# EAGLE schematic drone_controller (EAGLE 9.6.2)
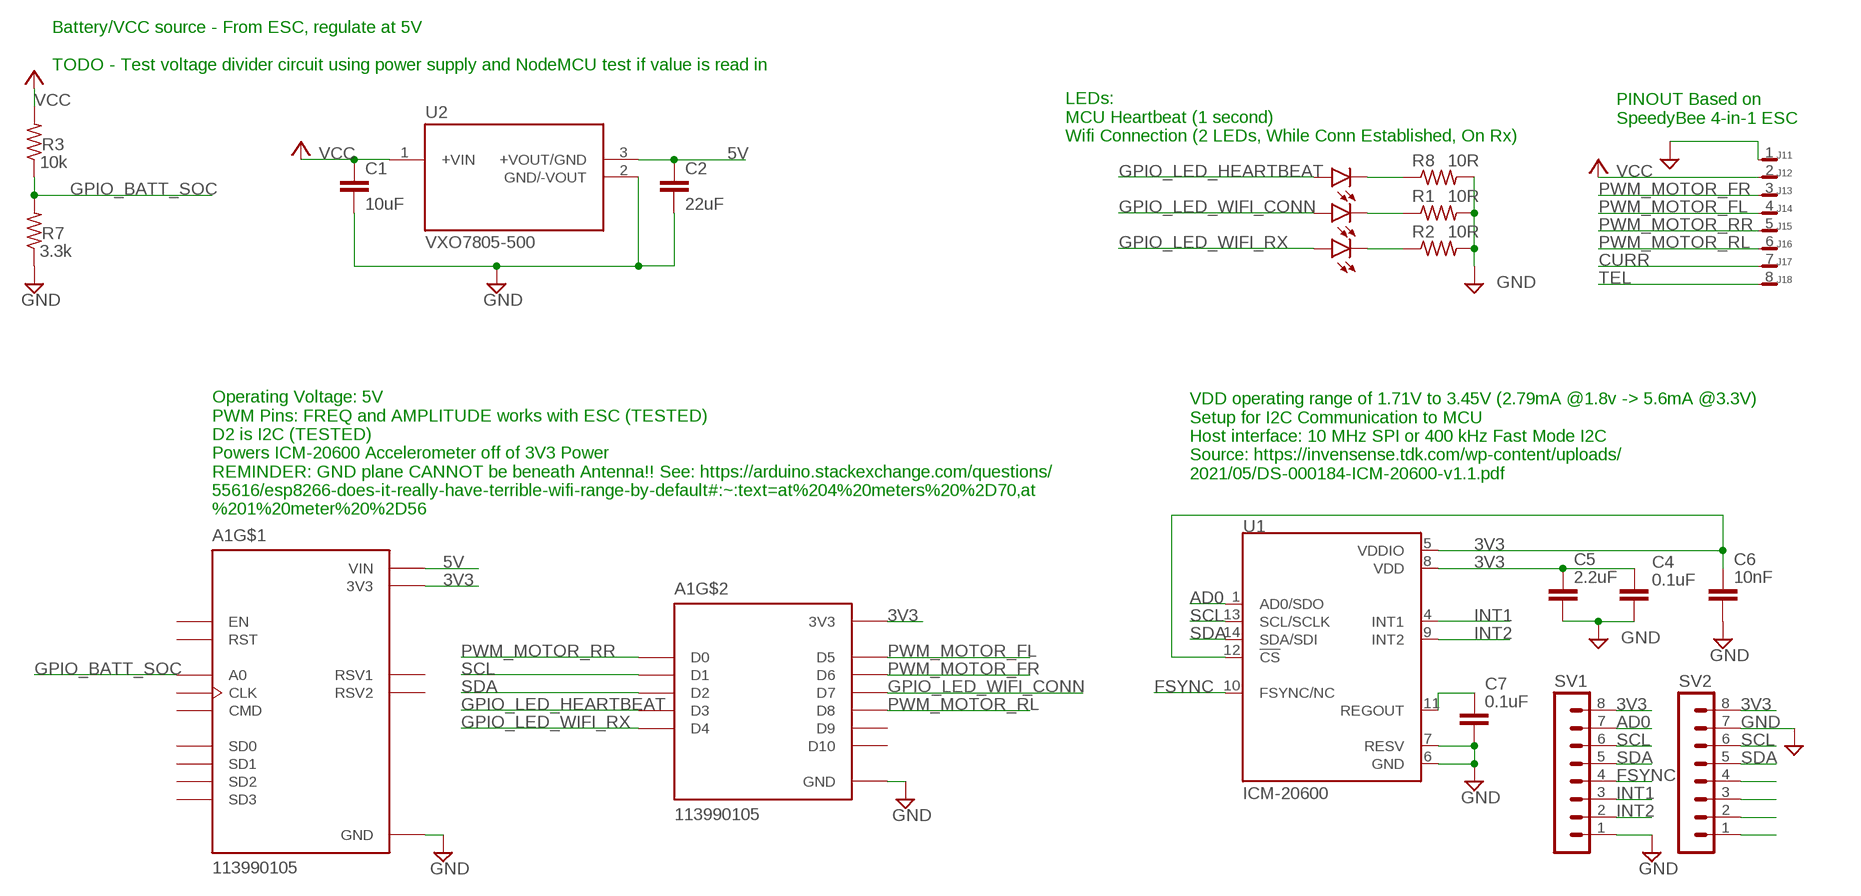
[diagram p0: schematic, sheet 1]

## Parts
A1  113990105  [SEEED_113990105]
C1  10uF  C2,5-3  [C2.5-3]
C2  22uF  C2,5-3  [C2.5-3]
C4  0.1uF  C2,5-3  [C2.5-3]
C5  2.2uF  C2,5-3  [C2.5-3]
C6  10nF  C2,5-3  [C2.5-3]
C7  0.1uF  C2,5-3  [C2.5-3]
J1  SM08B-SRSS-TB  [SM08B-SRSS-TB]
LED4  LED5MM  [LED5MM]
LED5  LED5MM  [LED5MM]
LED6  LED5MM  [LED5MM]
R1  10R  R-US_0204/7  [0204/7]
R2  10R  R-US_0204/7  [0204/7]
R3  10k  R-US_0204/7  [0204/7]
R7  3.3k  R-US_0204/7  [0204/7]
R8  10R  R-US_0204/7  [0204/7]
SV1  MA08-1  [MA08-1]
SV2  MA08-1  [MA08-1]
U1  ICM-20600  [PQFN50P250X300X97-14N]
U2  VXO7805-500  [CONV_VXO7805-500]

## Nets
3V3 [IMU]: A1.J1_11(3V3) A1.J2_6(3V3) A1.J2_15(3V3) C4.1 C5.1 C6.1 SV1.8 SV2.8 U1.5(VDDIO) U1.8(VDD) U1.12(!CS)
5V [Chip Power]: A1.J1_15(VIN) C2.1 U2.3(+VOUT/GND)
AD0 [IMU]: SV1.7 U1.1(AD0/SDO)
CURR: J1.7
FSYNC [IMU]: SV1.4 U1.10(FSYNC/NC)
GND [Power]: A1.J1_10(GND) A1.J1_14(GND) A1.J2_7(GND) A1.J2_14(GND) C1.2 C2.2 C4.2 C5.2 C6.2 C7.2 J1.1 R1.2 R2.2 R7.1 R8.2 SV1.1 SV2.7 U1.6(GND) U1.7(RESV) U2.2(GND/-VOUT)
GPIO_BATT_SOC [GPIO]: A1.J1_1(A0) R3.1 R7.2
GPIO_LED_HEARTBEAT [GPIO]: A1.J2_4(D3) LED4.A
GPIO_LED_WIFI_CONN [GPIO]: A1.J2_10(D7) LED5.A
GPIO_LED_WIFI_RX [GPIO]: A1.J2_5(D4) LED6.A
INT: SV2.1
INT1 [IMU]: SV1.3 U1.4(INT1)
INT2 [IMU]: SV1.2 U1.9(INT2)
N$1: C7.1 U1.11(REGOUT)
N$9: LED5.K(C) R1.1
N$10: LED4.K(C) R8.1
N$14: LED6.K(C) R2.1
N$17: SV2.4
N$18: SV2.3
N$19: SV2.2
PWM_MOTOR_FL [GPIO]: A1.J2_8(D5) J1.4
PWM_MOTOR_FR [GPIO]: A1.J2_9(D6) J1.3
PWM_MOTOR_RL [GPIO]: A1.J2_11(D8) J1.6
PWM_MOTOR_RR [GPIO]: A1.J2_1(D0) J1.5
SCL [IMU]: A1.J2_2(D1) SV1.6 SV2.6 U1.13(SCL/SCLK)
SDA [IMU]: A1.J2_3(D2) SV1.5 SV2.5 U1.14(SDA/SDI)
TEL: J1.8
VCC [Power]: C1.1 J1.2 R3.2 U2.1(+VIN)
Unconnected: A1.J1_2(RSV1) A1.J1_3(RSV2) A1.J1_4(SD3) A1.J1_5(SD2) A1.J1_6(SD1) A1.J1_7(CMD) A1.J1_8(SD0) A1.J1_9(CLK) A1.J1_12(EN) A1.J1_13(RST) A1.J2_12(D9) A1.J2_13(D10) J1.M1 J1.M2

## Notes on the sheet
- Battery/VCC source - From ESC, regulate at 5V
  
  TODO - Test voltage divider circuit using power supply and NodeMCU test if value is read in
- PINOUT Based on 
  SpeedyBee 4-in-1 ESC
- LEDs:
  MCU Heartbeat (1 second)
  Wifi Connection (2 LEDs, While Conn Established, On Rx)
- VDD operating range of 1.71V to 3.45V (2.79mA @1.8v -> 5.6mA @3.3V)
  Setup for I2C Communication to MCU
  Host interface: 10 MHz SPI or 400 kHz Fast Mode I2C
  Source: https://invensense.tdk.com/wp-content/uploads/
  2021/05/DS-000184-ICM-20600-v1.1.pdf
- Operating Voltage: 5V
  PWM Pins: FREQ and AMPLITUDE works with ESC (TESTED)
  D2 is I2C (TESTED)
  Powers ICM-20600 Accelerometer off of 3V3 Power
  REMINDER: GND plane CANNOT be beneath Antenna!! See: https://arduino.stackexchange.com/questions/
  55616/esp8266-does-it-really-have-terrible-wifi-range-by-default#:~:text=at%204%20meters%20%2D70,at
  %201%20meter%20%2D56

## Library data of the parts
A1 = 113990105:113990105: NodeMCU v2 - Lua based ESP8266 development kit Check availability <https://pricing.snapeda.com/parts/NodeMCU%20v2/Seeed%20Technology/view-part?ref=eda>; AVAILABILITY: Not in stock; DESCRIPTION: An open-source firmware and development kit that helps you to Prototype your IOT product within a few Lua script lines; MF: Seeed Technology; MP: NodeMCU v2; PACKAGE: None; PRICE: None
C1 C2 C4-C7 = capacitor-wima:C: CAPACITOR naming: grid - package width
J1 = con-JST-SH:SM08B-SRSS-TB
LED4-LED6 = led:LED: LED OSRAM: - CHIPLED LG R971, LG N971, LY N971, LG Q971, LY Q971, LO R971, LY R971 LH N974, LH R974 LS Q976, LO Q976, LY Q976 LO Q996 - Hyper CHIPLED LW Q18S LB Q993, LB Q99A, LB R99A - SideLED LS A670, LO A670, LY A670, LG A670, LP A670 LB A673, LV A673, LT A673, LW A673 LH A674 LY A675 LS A676, LA A676, LO A676, LY A676, LW A676 LS A679, LY A679, LG A679 - Hyper Micro SIDELED® LS Y876, LA Y876, LO Y876, LY Y876 LT Y87S - SmartLED LW L88C, LW L88S LB L89C, LB L89S, LG L890 LS L89K, LO L89K, LY L89K LS L896, LA L896, LO L896, LY L896 - TOPLED LS T670, LO T670, LY T670, LG T670, LP T670 LSG T670, LSP T670, LSY T670, LOP T670, LYG T670 LG T671, LOG T671, LSG T671 LB T673, LV T673, LT T673, LW T673 LH T674 LS T676, LA T676, LO T676, LY T676, LB T676, LH T676, LSB T676, LW T676 LB T67C, LV T67C, LT T67C, LS T67K, LO T67K, LY T67K, LW E67C LS E67B, LA E67B, LO E67B, LY E67B, LB E67C, LV E67C, LT E67C LW T67C LS T679, LY T679, LG T679 LS T770, LO T770, LY T770, LG T770, LP T770 LB T773, LV T773, LT T773, LW T773 LH T774 LS E675, LA E675, LY E675, LS T675 LS T776, LA T776, LO T776, LY T776, LB T776 LHGB T686 LT T68C, LB T68C - Hyper Mini TOPLED® LB M676 - Mini TOPLED Santana® LG M470 LS M47K, LO M47K, LY M47K Source: http://www.osram.convergy.de LUXEON: - LUMILED® LXK2-PW12-R00, LXK2-PW12-S00, LXK2-PW14-U00, LXK2-PW14-V00 LXK2-PM12-R00, LXK2-PM12-S00, LXK2-PM14-U00 LXK2-PE12-Q00, LXK2-PE12-R00, LXK2-PE12-S00, LXK2-PE14-T00, LXK2-PE14-U00 LXK2-PB12-K00, LXK2-PB12-L00, LXK2-PB12-M00, LXK2-PB14-N00, LXK2-PB14-P00, LXK2-PB14-Q00 LXK2-PR12-L00, LXK2-PR12-M00, LXK2-PR14-Q00, LXK2-PR14-R00 LXK2-PD12-Q00, LXK2-PD12-R00, LXK2-PD12-S00 LXK2-PH12-R00, LXK2-PH12-S00 LXK2-PL12-P00, LXK2-PL12-Q00, LXK2-PL12-R00 Source: www.luxeon.com KINGBRIGHT: KA-3528ASYC Source: www.kingbright.com
R1-R3 R7 R8 = rcl:R-US_: RESISTOR, American symbol; SPICEPREFIX: R
SV1 SV2 = con-lstb:MA08-1: PIN HEADER; OC_FARNELL: unknown; OC_NEWARK: unknown
U1 = ICM-20600:ICM-20600: Low-Power, High-Performance Integrated 6-Axis MEMS MotionTracking Device in 2.5mm x 3mm Package Check availability <https://pricing.snapeda.com/parts/ICM-20600/TDK%20InvenSense/view-part?ref=eda>; AVAILABILITY: In Stock; DESCRIPTION: Accelerometer, Gyroscope, 6 Axis Sensor I²C, SPI Output; MF: TDK InvenSense; MP: ICM-20600; PACKAGE: PQFN-14N TDK-InvenSense; PRICE: None; PURCHASE-URL: https://pricing.snapeda.com/search/part/ICM-20600/?ref=eda
U2 = VXO7805-500:VXO7805-500: Check availability <https://pricing.snapeda.com/parts/VXO7805-500/CUI/view-part?ref=eda>; AVAILABILITY: In Stock; CUI_PURCHASE_URL: https://www.cui.com/product/dc-dc-converters/non-isolated/vxo78-500-series?utm_source=snapeda.com&utm_medium=referral&utm_campaign=snapedaBOM; DESCRIPTION: 500 mA Output Current, 4.75~36 Vdc Input, 3 Pin SIP, Non-Isolated, Dc-Dc Converter; MF: CUI; MP: VXO7805-500; PACKAGE: None; PRICE: None; PURCHASE-URL: https://pricing.snapeda.com/search/part/VXO7805-500/?ref=eda

## Net classes
0 default: width 0.178 mm, drill 0.508 mm, clearance 0.051 mm
1 Power: width 0.305 mm, drill 0.508 mm, clearance 0.254 mm
3 Chip Power: width 0.025 mm, drill 0.051 mm, clearance 0.254 mm to class 2, clearance 0.127 mm
4 GPIO: width 0.254 mm, drill 0.508 mm, clearance 0.254 mm to class 2, clearance 0.254 mm
5 IMU: width 0.025 mm, drill 0.025 mm, clearance 0.025 mm to class 0